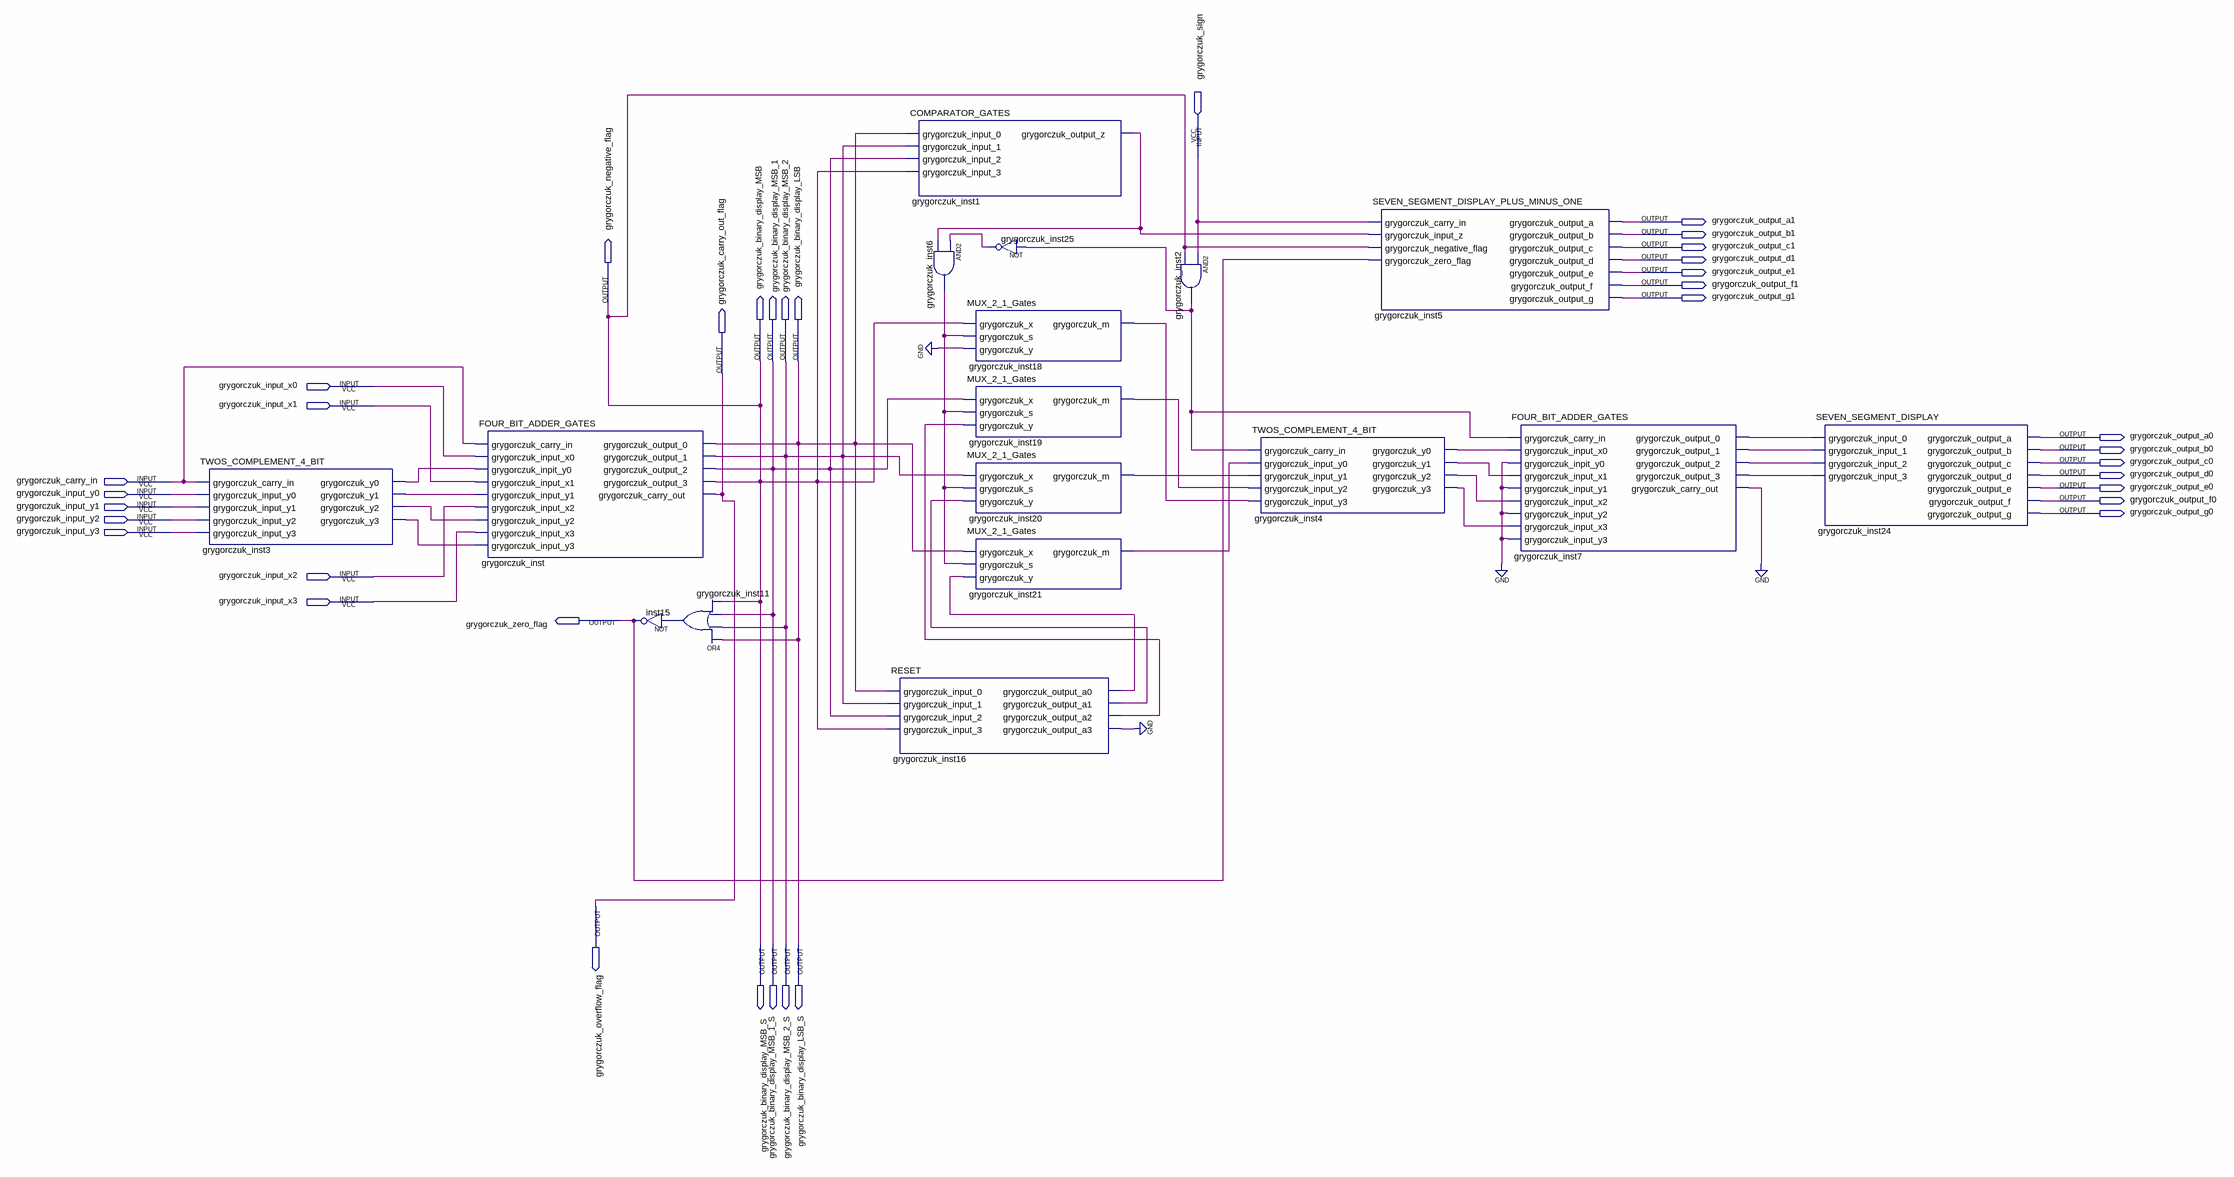
[diagram p0: schematic sheet]
// Quartus schematic PROJECT_1.bdf as structural Verilog: 17 symbols, 36 pins
module PROJECT_1 (
  input  grygorczuk_sign,
  input  grygorczuk_input_x0,
  input  grygorczuk_input_x1,
  input  grygorczuk_carry_in,
  input  grygorczuk_input_y0,
  input  grygorczuk_input_y1,
  input  grygorczuk_input_y2,
  input  grygorczuk_input_y3,
  input  grygorczuk_input_x2,
  input  grygorczuk_input_x3,
  output grygorczuk_output_a1,
  output grygorczuk_output_b1,
  output grygorczuk_output_c1,
  output grygorczuk_output_d1,
  output grygorczuk_output_e1,
  output grygorczuk_output_f1,
  output grygorczuk_output_g1,
  output grygorczuk_negative_flag,
  output grygorczuk_binary_display_MSB,
  output grygorczuk_binary_display_MSB_1,
  output grygorczuk_binary_display_MSB_2,
  output grygorczuk_binary_display_LSB,
  output grygorczuk_carry_out_flag,
  output grygorczuk_output_a0,
  output grygorczuk_output_b0,
  output grygorczuk_output_c0,
  output grygorczuk_output_d0,
  output grygorczuk_output_e0,
  output grygorczuk_output_f0,
  output grygorczuk_output_g0,
  output grygorczuk_zero_flag,
  output grygorczuk_overflow_flag,
  output grygorczuk_binary_display_MSB_S,
  output grygorczuk_binary_display_MSB_1_S,
  output grygorczuk_binary_display_MSB_2_S,
  output grygorczuk_binary_display_LSB_S
);

  wire grygorczuk_inst1_grygorczuk_output_z, grygorczuk_inst2_out, grygorczuk_inst3_grygorczuk_y0,
       grygorczuk_inst3_grygorczuk_y1, grygorczuk_inst3_grygorczuk_y2, grygorczuk_inst3_grygorczuk_y3,
       grygorczuk_inst4_grygorczuk_y0, grygorczuk_inst4_grygorczuk_y1, grygorczuk_inst4_grygorczuk_y2,
       grygorczuk_inst4_grygorczuk_y3, grygorczuk_inst6_out, grygorczuk_inst7_grygorczuk_carry_out,
       grygorczuk_inst7_grygorczuk_output_0, grygorczuk_inst7_grygorczuk_output_1,
       grygorczuk_inst7_grygorczuk_output_2, grygorczuk_inst7_grygorczuk_output_3, grygorczuk_inst11_out,
       grygorczuk_inst16_grygorczuk_output_a0, grygorczuk_inst16_grygorczuk_output_a1,
       grygorczuk_inst16_grygorczuk_output_a2, grygorczuk_inst16_grygorczuk_output_a3,
       grygorczuk_inst18_grygorczuk_m, grygorczuk_inst19_grygorczuk_m, grygorczuk_inst20_grygorczuk_m,
       grygorczuk_inst21_grygorczuk_m, grygorczuk_inst25_out;

  TWOS_COMPLEMENT_4_BIT grygorczuk_inst3 (
    .grygorczuk_carry_in(grygorczuk_carry_in), .grygorczuk_input_y0(grygorczuk_input_y0),
    .grygorczuk_input_y1(grygorczuk_input_y1), .grygorczuk_input_y2(grygorczuk_input_y2),
    .grygorczuk_input_y3(grygorczuk_input_y3), .grygorczuk_y0(grygorczuk_inst3_grygorczuk_y0),
    .grygorczuk_y1(grygorczuk_inst3_grygorczuk_y1), .grygorczuk_y2(grygorczuk_inst3_grygorczuk_y2),
    .grygorczuk_y3(grygorczuk_inst3_grygorczuk_y3));
  FOUR_BIT_ADDER_GATES grygorczuk_inst (
    .grygorczuk_carry_in(grygorczuk_carry_in), .grygorczuk_input_x0(grygorczuk_input_x0),
    .grygorczuk_inpit_y0(grygorczuk_inst3_grygorczuk_y0), .grygorczuk_input_x1(grygorczuk_input_x1),
    .grygorczuk_input_y1(grygorczuk_inst3_grygorczuk_y1), .grygorczuk_input_x2(grygorczuk_input_x2),
    .grygorczuk_input_y2(grygorczuk_inst3_grygorczuk_y2), .grygorczuk_input_x3(grygorczuk_input_x3),
    .grygorczuk_input_y3(grygorczuk_inst3_grygorczuk_y3),
    .grygorczuk_output_0(grygorczuk_binary_display_LSB),
    .grygorczuk_output_1(grygorczuk_binary_display_MSB_2),
    .grygorczuk_output_2(grygorczuk_binary_display_MSB_1),
    .grygorczuk_output_3(grygorczuk_binary_display_MSB), .grygorczuk_carry_out(grygorczuk_carry_out_flag));
  not inst15 (grygorczuk_zero_flag, grygorczuk_inst11_out);
  or grygorczuk_inst11 (grygorczuk_inst11_out, grygorczuk_binary_display_LSB, grygorczuk_binary_display_MSB_2, grygorczuk_binary_display_MSB_1, grygorczuk_binary_display_MSB);
  RESET grygorczuk_inst16 (
    .grygorczuk_input_0(grygorczuk_binary_display_LSB), .grygorczuk_input_1(grygorczuk_binary_display_MSB_2),
    .grygorczuk_input_2(grygorczuk_binary_display_MSB_1), .grygorczuk_input_3(grygorczuk_binary_display_MSB),
    .grygorczuk_output_a0(grygorczuk_inst16_grygorczuk_output_a0),
    .grygorczuk_output_a1(grygorczuk_inst16_grygorczuk_output_a1),
    .grygorczuk_output_a2(grygorczuk_inst16_grygorczuk_output_a2),
    .grygorczuk_output_a3(grygorczuk_inst16_grygorczuk_output_a3));
  COMPARATOR_GATES grygorczuk_inst1 (
    .grygorczuk_input_0(grygorczuk_binary_display_LSB), .grygorczuk_input_1(grygorczuk_binary_display_MSB_2),
    .grygorczuk_input_2(grygorczuk_binary_display_MSB_1), .grygorczuk_input_3(grygorczuk_binary_display_MSB),
    .grygorczuk_output_z(grygorczuk_inst1_grygorczuk_output_z));
  and grygorczuk_inst6 (grygorczuk_inst6_out, grygorczuk_inst25_out, grygorczuk_inst1_grygorczuk_output_z);
  not grygorczuk_inst25 (grygorczuk_inst25_out, grygorczuk_inst2_out);
  MUX_2_1_Gates grygorczuk_inst18 (
    .grygorczuk_x(grygorczuk_binary_display_MSB), .grygorczuk_s(grygorczuk_inst6_out), .grygorczuk_y(1'b0),
    .grygorczuk_m(grygorczuk_inst18_grygorczuk_m));
  MUX_2_1_Gates grygorczuk_inst19 (
    .grygorczuk_x(grygorczuk_binary_display_MSB_1), .grygorczuk_s(grygorczuk_inst6_out),
    .grygorczuk_y(grygorczuk_inst16_grygorczuk_output_a2), .grygorczuk_m(grygorczuk_inst19_grygorczuk_m));
  MUX_2_1_Gates grygorczuk_inst20 (
    .grygorczuk_x(grygorczuk_binary_display_MSB_2), .grygorczuk_s(grygorczuk_inst6_out),
    .grygorczuk_y(grygorczuk_inst16_grygorczuk_output_a1), .grygorczuk_m(grygorczuk_inst20_grygorczuk_m));
  MUX_2_1_Gates grygorczuk_inst21 (
    .grygorczuk_x(grygorczuk_binary_display_LSB), .grygorczuk_s(grygorczuk_inst6_out),
    .grygorczuk_y(grygorczuk_inst16_grygorczuk_output_a0), .grygorczuk_m(grygorczuk_inst21_grygorczuk_m));
  and grygorczuk_inst2 (grygorczuk_inst2_out, grygorczuk_sign, grygorczuk_binary_display_MSB);
  TWOS_COMPLEMENT_4_BIT grygorczuk_inst4 (
    .grygorczuk_carry_in(grygorczuk_inst2_out), .grygorczuk_input_y0(grygorczuk_inst21_grygorczuk_m),
    .grygorczuk_input_y1(grygorczuk_inst20_grygorczuk_m),
    .grygorczuk_input_y2(grygorczuk_inst19_grygorczuk_m),
    .grygorczuk_input_y3(grygorczuk_inst18_grygorczuk_m), .grygorczuk_y0(grygorczuk_inst4_grygorczuk_y0),
    .grygorczuk_y1(grygorczuk_inst4_grygorczuk_y1), .grygorczuk_y2(grygorczuk_inst4_grygorczuk_y2),
    .grygorczuk_y3(grygorczuk_inst4_grygorczuk_y3));
  SEVEN_SEGMENT_DISPLAY_PLUS_MINUS_ONE grygorczuk_inst5 (
    .grygorczuk_carry_in(grygorczuk_sign), .grygorczuk_input_z(grygorczuk_inst1_grygorczuk_output_z),
    .grygorczuk_negative_flag(grygorczuk_binary_display_MSB), .grygorczuk_zero_flag(grygorczuk_zero_flag),
    .grygorczuk_output_a(grygorczuk_output_a1), .grygorczuk_output_b(grygorczuk_output_b1),
    .grygorczuk_output_c(grygorczuk_output_c1), .grygorczuk_output_d(grygorczuk_output_d1),
    .grygorczuk_output_e(grygorczuk_output_e1), .grygorczuk_output_f(grygorczuk_output_f1),
    .grygorczuk_output_g(grygorczuk_output_g1));
  FOUR_BIT_ADDER_GATES grygorczuk_inst7 (
    .grygorczuk_carry_in(grygorczuk_inst2_out), .grygorczuk_input_x0(grygorczuk_inst4_grygorczuk_y0),
    .grygorczuk_inpit_y0(1'b0), .grygorczuk_input_x1(grygorczuk_inst4_grygorczuk_y1),
    .grygorczuk_input_y1(1'b0), .grygorczuk_input_x2(grygorczuk_inst4_grygorczuk_y2),
    .grygorczuk_input_y2(1'b0), .grygorczuk_input_x3(grygorczuk_inst4_grygorczuk_y3),
    .grygorczuk_input_y3(1'b0), .grygorczuk_output_0(grygorczuk_inst7_grygorczuk_output_0),
    .grygorczuk_output_1(grygorczuk_inst7_grygorczuk_output_1),
    .grygorczuk_output_2(grygorczuk_inst7_grygorczuk_output_2),
    .grygorczuk_output_3(grygorczuk_inst7_grygorczuk_output_3),
    .grygorczuk_carry_out(grygorczuk_inst7_grygorczuk_carry_out));
  SEVEN_SEGMENT_DISPLAY grygorczuk_inst24 (
    .grygorczuk_input_0(grygorczuk_inst7_grygorczuk_output_0),
    .grygorczuk_input_1(grygorczuk_inst7_grygorczuk_output_1),
    .grygorczuk_input_2(grygorczuk_inst7_grygorczuk_output_2),
    .grygorczuk_input_3(grygorczuk_inst7_grygorczuk_output_3), .grygorczuk_output_a(grygorczuk_output_a0),
    .grygorczuk_output_b(grygorczuk_output_b0), .grygorczuk_output_c(grygorczuk_output_c0),
    .grygorczuk_output_d(grygorczuk_output_d0), .grygorczuk_output_e(grygorczuk_output_e0),
    .grygorczuk_output_f(grygorczuk_output_f0), .grygorczuk_output_g(grygorczuk_output_g0));

  assign grygorczuk_binary_display_LSB_S = grygorczuk_binary_display_LSB;
  assign grygorczuk_binary_display_MSB_1_S = grygorczuk_binary_display_MSB_1;
  assign grygorczuk_binary_display_MSB_2_S = grygorczuk_binary_display_MSB_2;
  assign grygorczuk_binary_display_MSB_S = grygorczuk_binary_display_MSB;
  assign grygorczuk_negative_flag = grygorczuk_binary_display_MSB;
  assign grygorczuk_overflow_flag = grygorczuk_carry_out_flag;
  // also tied to GND on the sheet: {grygorczuk_inst16_grygorczuk_output_a3, grygorczuk_inst7_grygorczuk_carry_out}
endmodule
